# EAGLE design senproj_final (EAGLE 7.5.0)
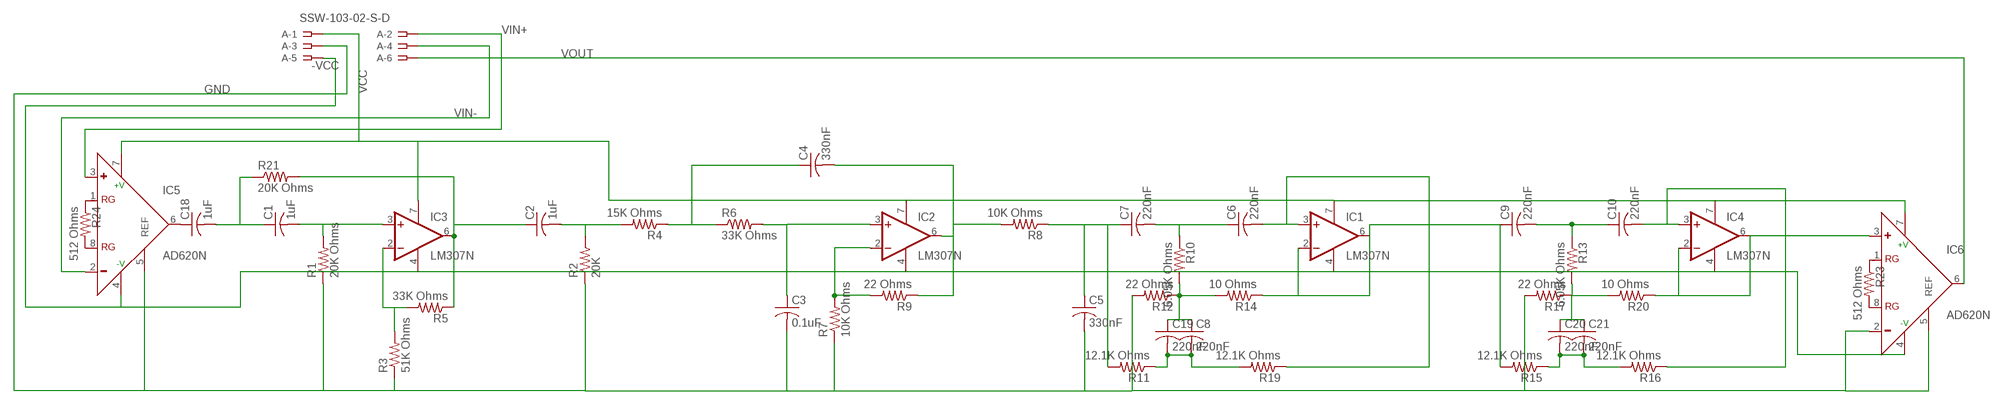
[diagram p0: schematic, sheet 1]

## Parts
A  SSW-103-02-S-D  [SSW-103-02-S-D]
C1  1uF  C-US150-054X183  [C150-054X183]
C2  1uF  C-US150-054X183  [C150-054X183]
C3  0.1uF  C-US075-032X103  [C075-032X103]
C4  330nF  C-US102-043X133  [C102-043X133]
C5  330nF  C-US102-043X133  [C102-043X133]
C6  220nF  C-US050-024X044  [C050-024X044]
C7  220nF  C-US050-024X044  [C050-024X044]
C8  220nF  C-US050-024X044  [C050-024X044]
C9  220nF  C-US050-024X044  [C050-024X044]
C10  220nF  C-US050-024X044  [C050-024X044]
C18  1uF  C-US150-054X183  [C150-054X183]
C19  220nF  C-US050-024X044  [C050-024X044]
C20  220nF  C-US050-024X044  [C050-024X044]
C21  220nF  C-US050-024X044  [C050-024X044]
IC1  LM307N  [DIL08]
IC2  LM307N  [DIL08]
IC3  LM307N  [DIL08]
IC4  LM307N  [DIL08]
IC5  AD620N  [DIL08]
IC6  AD620N  [DIL08]
R1  20K Ohms  R-US_0204/7  [0204/7]
R2  20K  R-US_0204/7  [0204/7]
R3  51K Ohms  R-US_0204/7  [0204/7]
R4  15K Ohms  R-US_0204/7  [0204/7]
R5  33K Ohms  R-US_0204/7  [0204/7]
R6  33K Ohms  R-US_0204/7  [0204/7]
R7  10K Ohms  R-US_0204/7  [0204/7]
R8  10K Ohms  R-US_0204/7  [0204/7]
R9  22 Ohms  R-US_0204/7  [0204/7]
R10  6.05K Ohms  R-US_0204/7  [0204/7]
R11  12.1K Ohms  R-US_0204/7  [0204/7]
R12  22 Ohms  R-US_0204/7  [0204/7]
R13  6.05K Ohms  R-US_0204/7  [0204/7]
R14  10 Ohms  R-US_0204/7  [0204/7]
R15  12.1K Ohms  R-US_0204/7  [0204/7]
R16  12.1K Ohms  R-US_0204/7  [0204/7]
R17  22 Ohms  R-US_0204/7  [0204/7]
R19  12.1K Ohms  R-US_0204/7  [0204/7]
R20  10 Ohms  R-US_0204/7  [0204/7]
R21  20K Ohms  R-US_0204/7  [0204/7]
R23  512 Ohms  R-US_0204/7  [0204/7]
R24  512 Ohms  R-US_0204/7  [0204/7]

## Nets
-VCC: A.5 IC1.4(V-) IC2.4(V-) IC3.4(V-) IC4.4(V-) IC5.4(-V) IC6.4(-V)
GND: A.3 C3.2 C5.2 IC5.5(REF) IC6.2(-) IC6.5(REF) R1.1 R2.1 R3.1 R7.1 R12.2 R17.2
N$1: C1.1 C18.2 R21.1
N$2: C1.2 IC3.3(+IN) R1.2
N$3: C4.1 R4.1 R6.1
N$4: IC3.2(-IN) R3.2 R5.2
N$5: C18.1 IC5.6(OUT)
N$6: C2.1 IC3.6(OUT) R5.1 R21.2
N$7: C2.2 R2.2 R4.2
N$8: IC2.2(-IN) R7.2 R9.2
N$9: C3.1 IC2.3(+IN) R6.2
N$10: C4.2 IC2.6(OUT) R8.2 R9.1
N$11: C5.1 C7.1 R8.1 R11.2
N$12: C8.1 C19.1 R10.2 R12.1 R14.2
N$13: C6.1 C7.2 R10.1
N$14: C8.2 C19.2 R11.1 R19.2
N$15: C6.2 IC1.3(+IN) R19.1
N$16: C9.1 IC1.2(-IN) IC1.6(OUT) R14.1 R15.2
N$19: C20.1 C21.1 R13.2 R17.1 R20.2
N$20: C9.2 C10.1 R13.1
N$21: C20.2 C21.2 R15.1 R16.2
N$22: C10.2 IC4.3(+IN) R16.1
N$23: IC4.2(-IN) IC4.6(OUT) IC6.3(+) R20.1
N$29: IC5.8(RG) R24.2
N$30: IC5.1(RG) R24.1
N$31: IC6.8(RG) R23.2
N$32: IC6.1(RG) R23.1
VCC: A.1 IC1.7(V+) IC2.7(V+) IC3.7(V+) IC4.7(V+) IC5.7(+V) IC6.7(+V)
VIN+: A.2 IC5.3(+)
VIN-: A.4 IC5.2(-)
VOUT: A.6 IC6.6(OUT)

## Library data of the parts
A = con-samtec:SSW-103-02-S-D: THROUGH-HOLE .025" SQ POST SOCKET Source: Samtec SSW.pdf; MPN: SSW-103-02-S-D; OC_FARNELL: unknown; OC_NEWARK: 11P9365
C1-C10 C18-C21 = resistor:C-US: CAPACITOR, American symbol
IC1-IC4 = linear:LM307: OP AMP
IC5 IC6 = analog-devices:AD620: Low Cost, Low Power, Instrumentation Amplifier Source: http://www.analog.com/UploadedFiles/Data_Sheets/37793330023930AD620_e.pdf; MF: ALTERA CORPORATION; MPN: AD620AN; OC_FARNELL: 1523782; OC_NEWARK: 05F7108
R1-R17 R19-R21 R23 R24 = resistor:R-US_: RESISTOR, American symbol

## Board
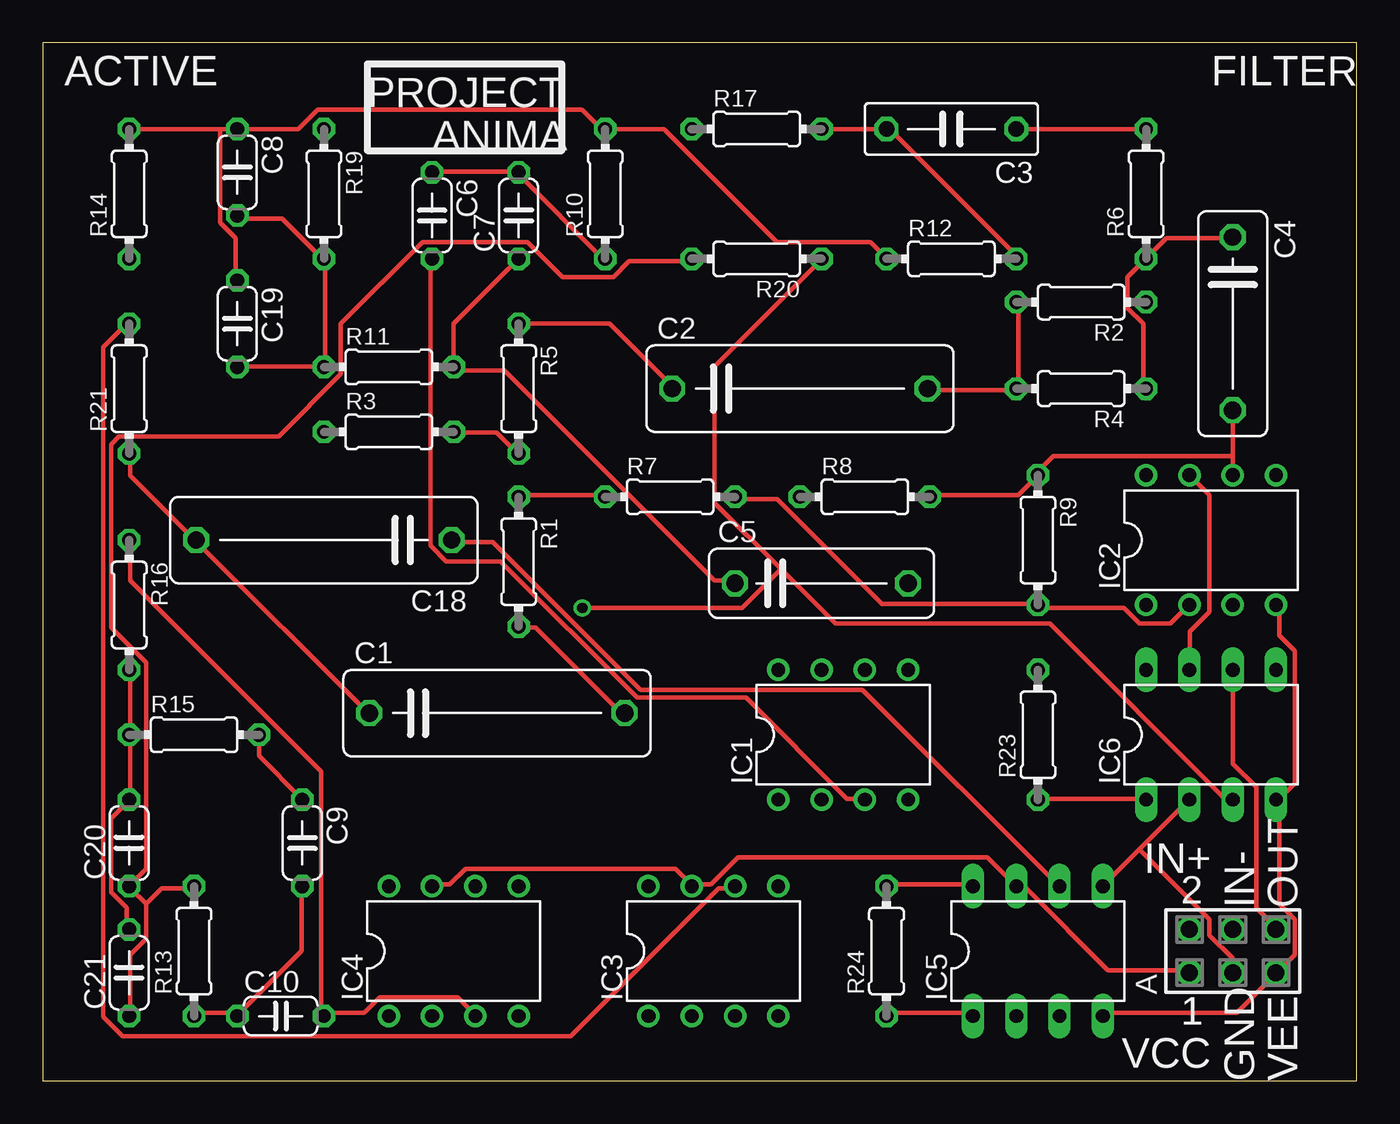
[diagram p1: board, top side]
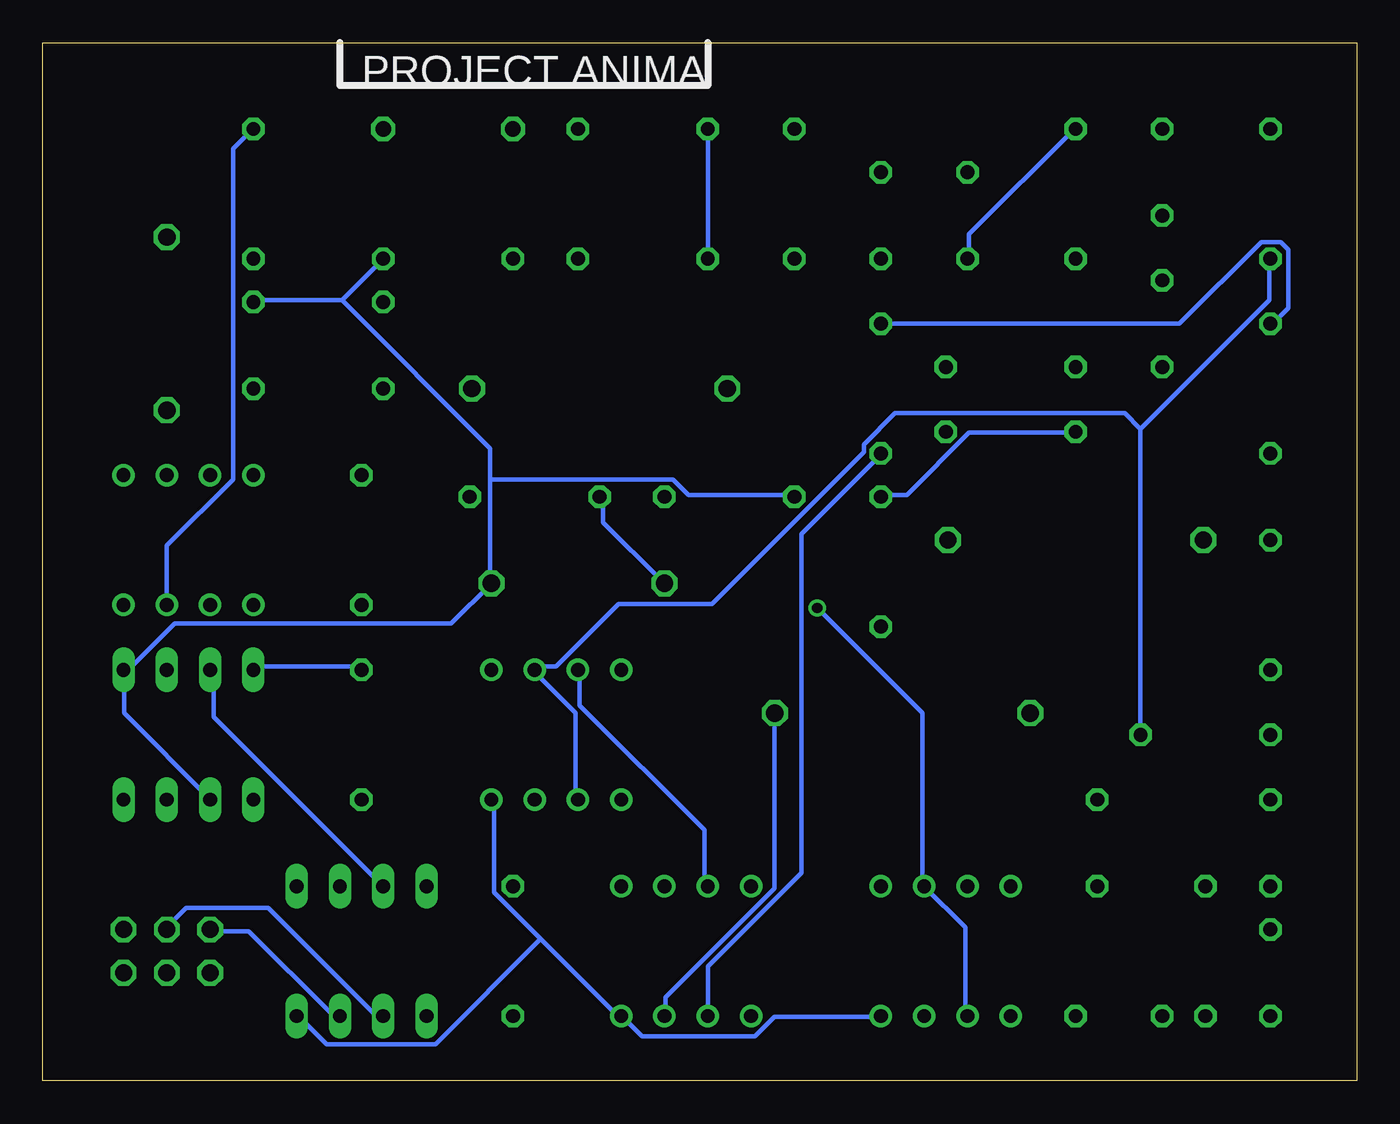
[diagram p2: board, bottom side, seen from below]

Size 77.14 x 60.95 mm. Coordinates in mm from the lower left corner, seen from the top.
Outline: 0,0 77.14,0 77.14,60.95 0,60.95 0,0
Copper layers (1*16): Top 0.035mm / dielectric 1.5mm / Bottom 0.035mm
Design rules "default": minimum track width 10mil, minimum drill 24mil, track to track 8mil, track to pad 8mil, pad to pad 8mil, via to via 8mil, smd to smd 8mil, copper to edge 40mil, drill to drill 8mil, minimum pad ring 10mil, minimum via ring 8mil, stop-mask expansion 4mil, vias tented up to drill 0mil, thermal gap 10mil

### Footprints (pad centres in the part's own frame; a part is rotated, then mirrored left to right if it is on the bottom)
SSW-103-02-S-D = drill 1 pad 1.5 octagon: 1 -2.54,-1.27; 2 -2.54,1.27; 3 0,-1.27; 4 0,1.27; 5 2.54,-1.27; 6 2.54,1.27
C150-054X183 = drill 1.016 octagon: 1 -7.493,0; 2 7.493,0
C075-032X103 = drill 0.914 octagon: 1 -3.81,0; 2 3.81,0
C102-043X133 = drill 1.016 octagon: 1 -5.08,0; 2 5.08,0
C050-024X044 = drill 0.813 octagon: 1 -2.54,0; 2 2.54,0
DIL08 = drill 0.813 pad 1.27: 1 -3.81,-3.81; 2 -1.27,-3.81; 3 1.27,-3.81; 4 3.81,-3.81; 5 3.81,3.81; 6 1.27,3.81; 7 -1.27,3.81; 8 -3.81,3.81
DIL08' = drill 0.813 long: 1 -3.81,-3.81; 2 -1.27,-3.81; 3 1.27,-3.81; 4 3.81,-3.81; 5 3.81,3.81; 6 1.27,3.81; 7 -1.27,3.81; 8 -3.81,3.81
0204/7 = drill 0.813 octagon: 1 -3.81,0; 2 3.81,0

### Placement (x,y rotation side)
A  69.85,7.62 0 top
C1  26.67,21.59 0 top
C2  44.45,40.64 0 top
C3  53.34,55.88 180 top
C4  69.85,44.45 270 top
C5  45.72,29.21 0 top
C6  22.86,50.8 270 top
C7  27.94,50.8 90 top
C8  11.43,53.34 270 top
C9  15.24,13.97 270 top
C10  13.97,3.81 0 top
C18  16.51,31.75 180 top
C19  11.43,44.45 270 top
C20  5.08,13.97 90 top
C21  5.08,6.35 90 top
IC1  46.99,20.32 0 top
IC2  68.58,31.75 0 top
IC3  39.37,7.62 0 top
IC4  24.13,7.62 0 top
IC5  AD620N  [DIL08']  58.42,7.62 0 top
IC6  AD620N  [DIL08']  68.58,20.32 0 top
R1  27.94,30.48 270 top
R2  60.96,45.72 180 top
R3  20.32,38.1 0 top
R4  60.96,40.64 180 top
R5  27.94,40.64 270 top
R6  64.77,52.07 90 top
R7  36.83,34.29 0 top
R8  48.26,34.29 0 top
R9  58.42,31.75 270 top
R10  33.02,52.07 90 top
R11  20.32,41.91 0 top
R12  53.34,48.26 0 top
R13  8.89,7.62 90 top
R14  5.08,52.07 90 top
R15  8.89,20.32 0 top
R16  5.08,27.94 270 top
R17  41.91,55.88 0 top
R19  16.51,52.07 270 top
R20  41.91,48.26 180 top
R21  5.08,40.64 90 top
R23  58.42,20.32 90 top
R24  49.53,7.62 90 top

### Tracks (layer width: path | path; a pad name or v marks a point on that pad's centre or on a via)
-VCC
  Top 0.254: IC5.4 62.31,3.99 70.08,3.99 72.37,6.27 A.5 72.59,6.5 73.51,7.42 73.51,9.47 72.59,10.39 72.59,16.33 IC6.4 72.59,16.56 73.51,17.48 73.51,25.25 72.59,26.16 72.59,27.76 IC2.4
  Bottom 0.254: IC4.4 28.02,3.76 34.19,3.76 35.33,2.62 41.96,2.62 43.1,3.76 IC3.4 43.33,3.76 47.9,8.33 | 47.9,8.33 50.65,11.07 50.65,16.33 IC1.4 | 47.9,8.33 54.08,2.16 60.48,2.16 62.08,3.76 IC5.4
GND
  Top 0.254: 64.36,13.59 67.11,16.33 IC6.2 | 64.36,13.59 62.31,11.53 IC5.5 | A.3 69.85,7.19 68.48,8.56 68.48,9.47 64.36,13.59 | R1.1 28.02,34.39 32.82,34.39 R7.1 | R17.2 C3.2 49.73,55.88 57.28,48.34 R12.2
  Bottom 0.254: IC6.2 67.34,16.56 72.37,21.59 72.37,24.11 IC6.5 72.37,24.33 71.91,24.33 69.39,26.85 53.16,26.85 C5.2 50.88,29.36 50.88,35.31 | R3.1 16.59,38.05 22.76,38.05 26.42,34.39 27.79,34.39 R1.1 | 59.56,45.82 64.59,45.82 R2.1 | 59.56,45.82 57.28,48.11 R12.2 | 50.88,35.31 50.88,37.13 59.56,45.82 | 50.88,35.31 40.13,35.31 39.22,34.39 33.05,34.39 R7.1
N$1
  Top 0.254: R21.1 5.16,36.68 5.16,35.53 8.81,31.88 C18.2 9.04,31.65 19.1,21.59 C1.1
N$2
  Top 0.254: R1.2 28.02,26.62 28.93,26.62 33.96,21.59 C1.2
  Bottom 0.254: IC3.3 40.59,3.99 40.59,4.9 34.19,11.3 34.19,21.59 C1.2
N$3
  Top 0.254: R4.1 64.59,40.79 64.59,44.45 63.68,45.36 63.68,47.19 64.59,48.11 R6.1 64.82,48.34 65.96,49.48 69.85,49.48 C4.1
N$4
  Top 0.254: R3.2 24.13,38.05 26.64,38.05 27.79,36.91 R5.2
  Bottom 0.254: IC3.2 38.08,3.99 38.08,6.73 32.59,12.22 32.59,32.11 28.02,36.68 R5.2
N$5
  Top 0.254: IC5.6 59.56,11.53 48.13,22.96 35.1,22.96 26.42,31.65 24.13,31.65 C18.1
N$6
  Top 0.254: R5.1 33.27,44.45 36.93,40.79 C2.1 | IC3.6 40.59,11.3 39.67,11.3 30.99,2.62 4.7,2.62 3.56,3.76 3.56,43.08 4.93,44.45 R21.2
  Bottom 0.254: R5.1 10.41,44.45 5.61,49.25 4.47,49.25 4.01,48.79 4.01,45.36 4.93,44.45 R21.2
N$7
  Top 0.254: R2.2 57.28,45.59 57.28,40.79 R4.2 57.05,40.56 52.02,40.56 C2.2
N$8
  Top 0.254: IC2.2 67.11,27.76 66.19,26.85 64.36,26.85 63.45,27.76 58.42,27.76 R9.2 58.42,27.99 49.28,27.99 43.1,34.16 40.82,34.16 R7.2
N$9
  Top 0.254: C3.1 R6.2
  Bottom 0.254: IC2.3 69.85,31.42 65.96,35.31 65.96,54.74 64.82,55.88 R6.2
N$10
  Top 0.254: C4.2 69.85,36.68 | 69.85,36.68 IC2.6 | R8.2 52.25,34.39 57.28,34.39 58.42,35.53 R9.1 58.42,35.76 59.33,36.68 69.85,36.68
N$11
  Top 0.254: C7.1 24.13,44.45 R11.2 24.13,41.71 27.1,41.71 39.45,29.36 40.59,29.36 C5.1
  Bottom 0.254: R8.1 44.25,34.16 44.25,32.79 40.82,29.36 C5.1
N$12
  Top 0.254: 10.41,55.88 C8.1 14.99,55.88 16.13,57.02 31.67,57.02 32.82,55.88 R10.2 36.47,55.88 43.1,49.25 48.59,49.25 49.5,48.34 R12.1 | 10.41,55.88 R14.2 | 10.41,55.88 10.41,50.39 11.33,49.48 11.33,47.19 C19.1
N$13
  Top 0.254: C6.1 22.99,53.36 27.79,53.36 C7.2 28.02,53.14 32.82,48.34 R10.1
N$14
  Top 0.254: C19.2 11.56,41.93 16.36,41.93 R11.1 16.59,41.93 16.59,48.11 R19.2 16.36,48.34 14.07,50.62 11.56,50.62 C8.2
N$15
  Top 0.254: IC1.3 48.13,16.56 47.22,16.56 41.28,22.5 34.87,22.5 26.87,30.5 23.67,30.5 22.76,31.42 22.76,48.11 C6.2
  Bottom 0.254: C6.2 22.76,48.34 22.76,49.71 16.59,55.88 R19.1
N$16
  Top 0.254: R15.2 12.7,19.07 15.21,16.56 C9.1
  Bottom 0.254: IC1.2 45.85,16.56 45.85,21.59 48.36,24.11 IC1.6 48.13,24.33 46.99,24.33 43.33,27.99 37.85,27.99 28.93,36.91 28.93,37.36 27.1,39.19 13.61,39.19 12.7,38.28 | 12.7,38.28 5.16,45.82 5.16,48.11 R14.1 | R15.2 12.7,38.28
N$19
  Top 0.254: 6.07,10.39 6.07,8.33 5.16,7.42 5.16,3.99 C21.1 | 6.07,10.39 5.16,11.3 C20.1 5.16,11.53 6.07,12.45 6.07,24.56 4.01,26.62 4.01,37.36 4.47,37.82 13.84,37.82 17.5,41.48 17.5,44.45 22.3,49.25 28.47,49.25 30.53,47.19 33.5,47.19 34.42,48.11 38.08,48.11 R20.2 | 6.07,10.39 6.98,11.3 8.81,11.3 R13.2
  Bottom 0.254: R20.2 38.08,48.34 38.08,55.88 R17.1
N$20
  Top 0.254: R13.1 9.04,3.99 11.33,3.99 C10.1 11.56,3.99 15.21,7.64 15.21,11.3 C9.2
N$21
  Top 0.254: R16.2 5.16,24.11 5.16,20.45 R15.1 5.16,20.22 5.16,16.56 C20.2 4.93,16.33 4.01,15.42 4.01,11.07 4.93,10.16 4.93,9.02 C21.2
N$22
  Top 0.254: IC4.3 25.27,3.99 24.36,4.9 19.79,4.9 18.87,3.99 16.59,3.99 C10.2 16.36,3.99 16.36,18.16 5.16,29.36 5.16,31.65 R16.1
N$23  (via drill 0.61)
  Top 0.254: 43.33,30.05 39.45,33.93 39.45,41.93 45.62,48.11 R20.1 | 43.33,30.05 46.53,26.85 59.11,26.85 69.39,16.56 69.85,16.56 IC6.3 | v31.67,27.76 41.05,27.76 43.33,30.05
  Bottom 0.254: IC4.2 22.99,3.99 22.99,9.02 IC4.6 25.5,11.53 25.5,21.59 v31.67,27.76
N$29
  Top 0.254: R24.2 49.73,11.53 54.53,11.53 IC5.8
N$30
  Top 0.254: R24.1 49.73,3.99 54.53,3.99 IC5.1
N$31
  Bottom 0.254: R23.2 58.42,24.33 64.59,24.33 IC6.8
N$32
  Top 0.254: R23.1 58.42,16.56 64.59,16.56 IC6.1
VCC
  Top 0.254: IC4.7 22.99,11.53 23.9,11.53 24.82,12.45 37.16,12.45 38.08,11.53 IC3.7 38.3,11.53 39.22,11.53 40.82,13.13 55.45,13.13 IC5.7 57.28,11.3 57.73,11.3 62.53,6.5 67.11,6.5 A.1 | IC2.7 68.48,34.39 68.48,27.53 67.34,26.39 67.34,24.33 IC6.7
  Bottom 0.254: IC1.7 45.62,24.11 45.62,22.05 38.3,14.73 38.3,11.53 IC3.7 | IC6.7 67.11,24.11 67.11,21.36 57.28,11.53 IC5.7
VIN+
  Bottom 0.254: IC5.3 59.79,3.99 60.25,3.99 65.05,8.79 67.11,8.79 A.2
VIN-
  Bottom 0.254: IC5.2 57.28,3.99 57.73,3.99 63.91,10.16 68.71,10.16 69.85,9.02 A.4
VOUT
  Top 0.254: IC6.6 69.85,18.62 71.22,17.25 71.22,10.16 72.37,9.02 A.6

### Text on the board
tPlace: ACTIVE | FILTER | PROJECT | ANIMA | IN+ | IN- | OUT | VCC | GND | VEE
bPlace: PROJECT ANIMA